# Altium schematic sheet LEDS_SENSOR_VS.SchDoc
size A
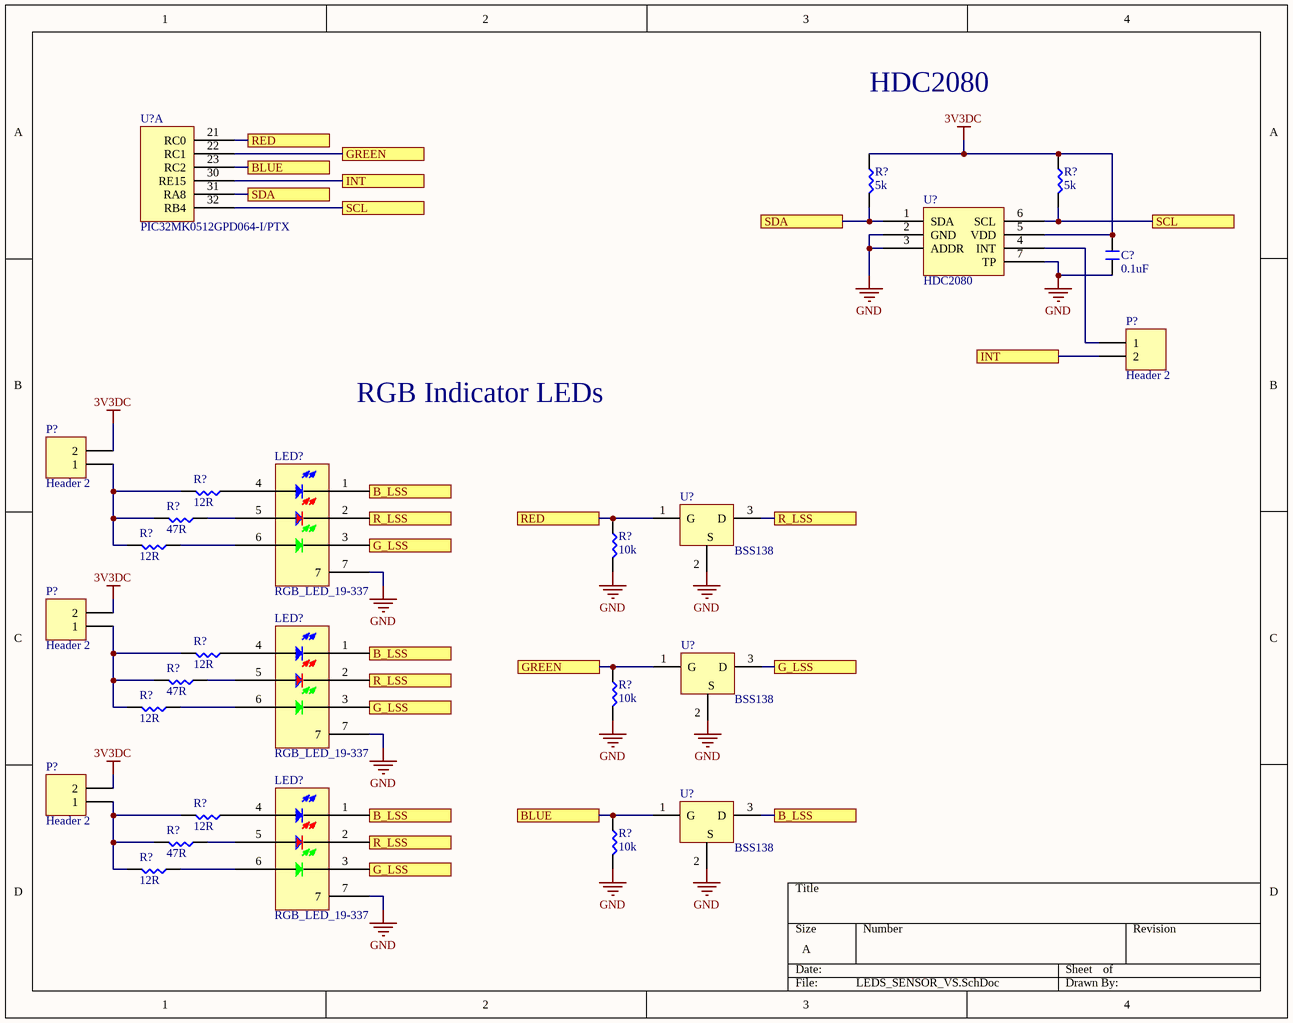
[diagram p0: LEDS_SENSOR_VS.SchDoc]

## Parts
(Parts that share a designator on the sheet are numbered #1, #2 ... from top to bottom, then left to right.)
C?  0.1uF  [NonPolar-0402]
LED?#1  RGB_LED_19-337  [RGB_LED_19-337]
LED?#2  RGB_LED_19-337  [RGB_LED_19-337]
LED?#3  RGB_LED_19-337  [RGB_LED_19-337]
P?#1  Header 2  [HDR1X2]
P?#2  Header 2  [HDR1X2]
P?#3  Header 2  [HDR1X2]
P?#4  Header 2  [HDR1X2]
R?#1  5k  [NonPolar-0603]
R?#2  5k  [NonPolar-0603]
R?#3  12R  [NonPolar-0603]
R?#4  47R  [NonPolar-0603]
R?#5  12R  [NonPolar-0603]
R?#6  10k  [NonPolar-0603]
R?#7  12R  [NonPolar-0603]
R?#8  47R  [NonPolar-0603]
R?#9  10k  [NonPolar-0603]
R?#10  12R  [NonPolar-0603]
R?#11  12R  [NonPolar-0603]
R?#12  47R  [NonPolar-0603]
R?#13  10k  [NonPolar-0603]
R?#14  12R  [NonPolar-0603]
U?#1  PIC32MK0512GPD064-I/PTX  (part A of 2)
U?#2  HDC2080
U?#3  BSS138  [BSS138-SOT23]
U?#4  BSS138  [BSS138-SOT23]
U?#5  BSS138  [BSS138-SOT23]

## Ports
B_LSS, BLUE, G_LSS, GREEN, INT, R_LSS, RED, SCL, SDA

## Nets
3V3DC: C?.2 P?#2.2 P?#3.2 P?#4.2 R?#1.2 R?#2.2 U?#2.5(VDD)
GND: C?.1 LED?#1.7 LED?#2.7 LED?#3.7 R?#6.1 R?#9.1 R?#13.1 U?#2.2(GND) U?#2.3(ADDR) U?#2.7(TP) U?#3.2(S) U?#4.2(S) U?#5.2(S)
B_LSS: LED?#1.1 LED?#2.1 LED?#3.1 U?#5.3(D) ; port B_LSS
BLUE: R?#13.2 U?#1.23(RC2) U?#5.1(G) ; port BLUE
G_LSS: LED?#1.3 LED?#2.3 LED?#3.3 U?#4.3(D) ; port G_LSS
GREEN: R?#9.2 U?#1.22(RC1) U?#4.1(G) ; port GREEN
INT: P?#1.2 U?#1.30(RE15) ; port INT
R_LSS: LED?#1.2 LED?#2.2 LED?#3.2 U?#3.3(D) ; port R_LSS
RED: R?#6.2 U?#1.21(RC0) U?#3.1(G) ; port RED
SCL: R?#2.1 U?#1.32(RB4) U?#2.6(SCL) ; port SCL
SDA: R?#1.1 U?#1.31(RA8) U?#2.1(SDA) ; port SDA
NetLED?#1_4: LED?#1.4 R?#3.2
NetLED?#1_5: LED?#1.5 R?#4.2
NetLED?#1_6: LED?#1.6 R?#5.2
NetLED?#2_4: LED?#2.4 R?#7.2
NetLED?#2_5: LED?#2.5 R?#8.2
NetLED?#2_6: LED?#2.6 R?#10.2
NetLED?#3_4: LED?#3.4 R?#11.2
NetLED?#3_5: LED?#3.5 R?#12.2
NetLED?#3_6: LED?#3.6 R?#14.2
NetP?#1_1: P?#1.1 U?#2.4(INT)
NetP?#2_1: P?#2.1 R?#3.1 R?#4.1 R?#5.1
NetP?#3_1: P?#3.1 R?#7.1 R?#8.1 R?#10.1
NetP?#4_1: P?#4.1 R?#11.1 R?#12.1 R?#14.1

## Notes on the sheet
- HDC2080
- RGB Indicator LEDs

## Library data of the parts
C? = Cap - 0402
P?#1-P?#4 = Header 2: Header, 2-Pin; LatestRevisionDate: 17-Jul-2002; LatestRevisionNote: Re-released for DXP Platform.; Publisher: Altium Limited
R?#1-R?#14 = Res - 0603